# Altium schematic sheet RT_SUPER_EXT.SchDoc
size A
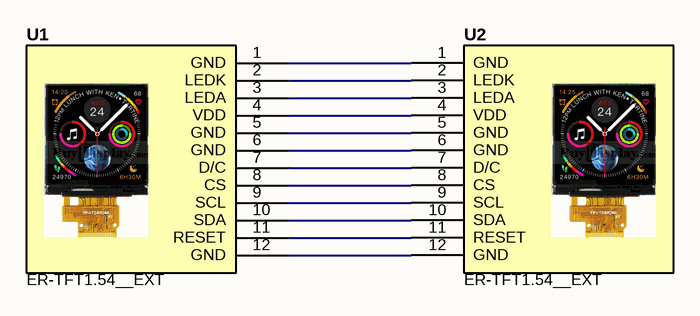
[diagram p0: RT_SUPER_EXT.SchDoc]

## Parts
U1  ER-TFT1.54__EXT  [ER-TFT1.54-1 - EXT]
U2  ER-TFT1.54__EXT  [ER-TFT1.54-1 - EXT]

## Nets
NetU1_1: U1.1(GND) U2.1(GND)
NetU1_2: U1.2(LEDK) U2.2(LEDK)
NetU1_3: U1.3(LEDA) U2.3(LEDA)
NetU1_4: U1.4(VDD) U2.4(VDD)
NetU1_5: U1.5(GND) U2.5(GND)
NetU1_6: U1.6(GND) U2.6(GND)
NetU1_7: U1.7(D/C) U2.7(D/C)
NetU1_8: U1.8(CS) U2.8(CS)
NetU1_9: U1.9(SCL) U2.9(SCL)
NetU1_10: U1.10(SDA) U2.10(SDA)
NetU1_11: U1.11(RESET) U2.11(RESET)
NetU1_12: U1.12(GND) U2.12(GND)

## Library data of the parts
U1 U2 = ER-TFT1.54__EXT: EXTENTION FOOTPRINT; Manufacturer: Buy Display; Manufacturer Part Number: ER-TFT1.54-1; Value: ER-TFT1.54__EXT